# Altium schematic sheet ESP32_S2_SOLO_2.SchDoc
size A4; SheetNumber: 2; SheetTotal: 7
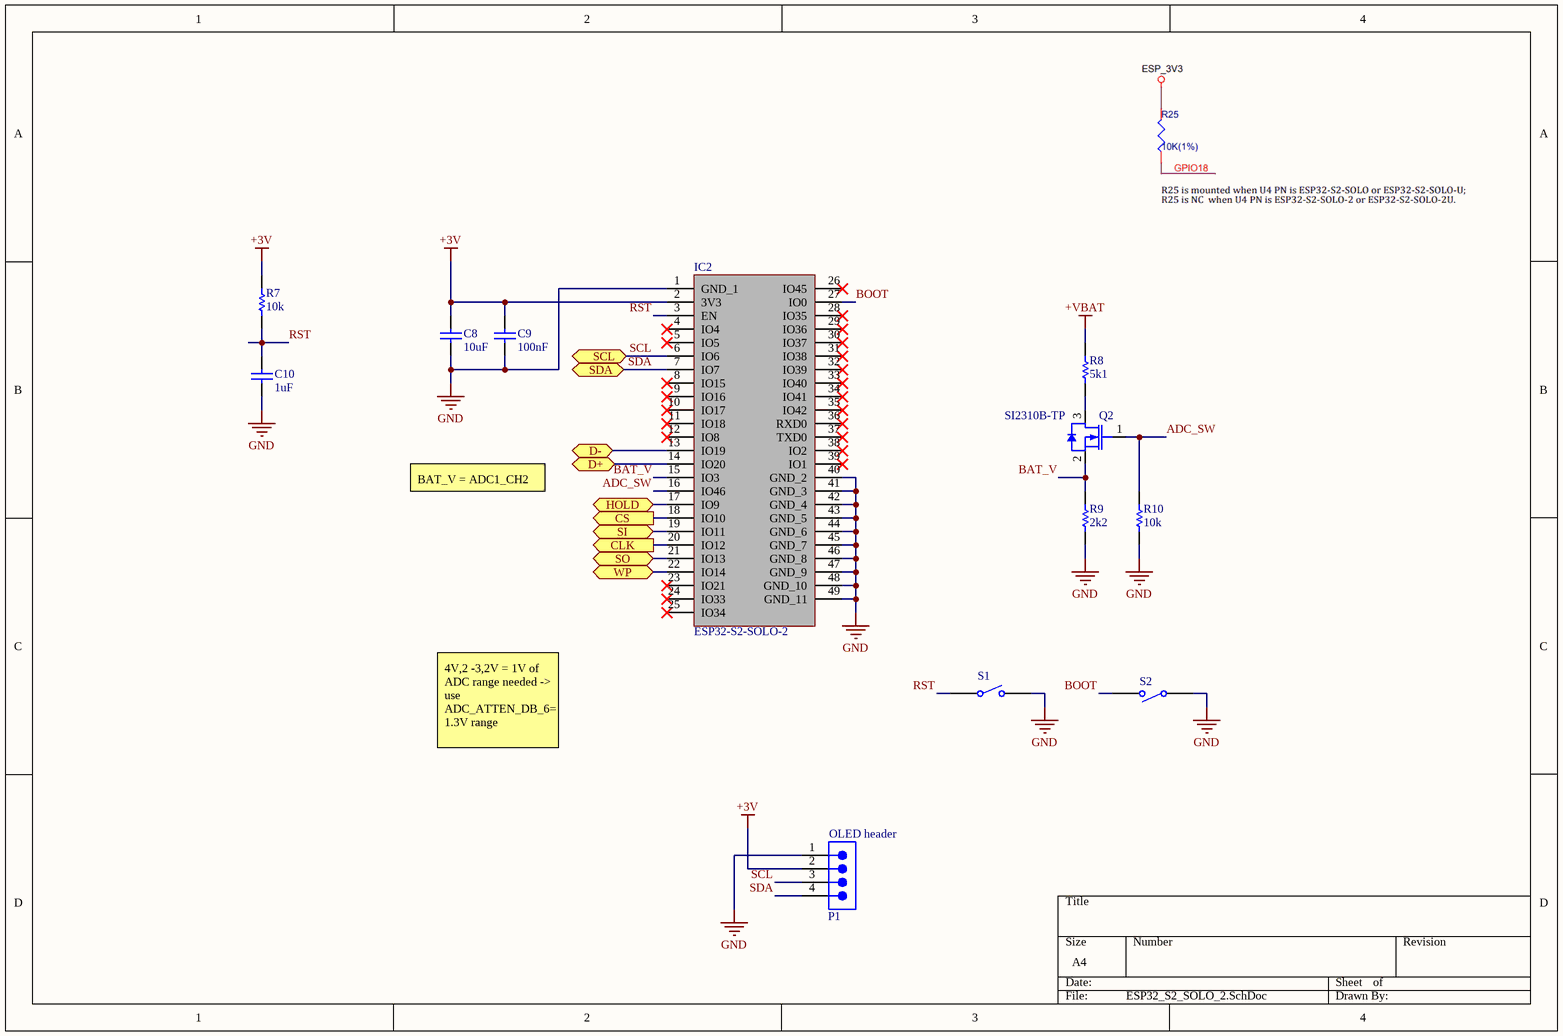
[diagram p0: ESP32_S2_SOLO_2.SchDoc]

## Parts
C8  value 10uF  [Wurth 0603 capacitor]  (hidden comment: Generic Capacitor 10uF 0603)
C9  value 100nF  [Wurth 0603 capacitor]  (hidden comment: Generic Capacitor 100nF 0603)
C10  value 1uF  [Wurth 0603 capacitor]  (hidden comment: Generic Capacitor 1uF 0603)
IC2  ESP32-S2-SOLO-2  [ESPRESSIF ESP32S2SOLO2]
P1  OLED header  [4x1 2.54mm F]
Q2  SI2310B-TP  [MCC SOT-23-3]
R7  value 10k  [Wurth 0603 Resistor]  (hidden comment: Generic Resistor 10k 0603)
R8  value 5k1  [0805 Resistor]  (hidden comment: Generic Resistor 5k1 0805)
R9  value 2k2  [Wurth 0603 Resistor]  (hidden comment: Generic Resistor 2k2 0603)
R10  value 10k  [Wurth 0603 Resistor]  (hidden comment: Generic Resistor 10k 0603)
S1  TS-1088R-02026  [TS1088R02026]  (value not drawn)
S2  TS-1088R-02026  [TS1088R02026]  (value not drawn)

## Ports
CLK (out), CS (out), D+ (bidir), D- (bidir), HOLD (bidir), SCL (bidir), SDA (bidir), SI (bidir), SO (bidir), WP (bidir)

## Nets
+3V: C8.2 C9.2 IC2.2(3V3) P1.2 R7.2
+VBAT: R8.2
GND: C8.1 C9.1 C10.1 IC2.1(GND_1) IC2.40(GND_2) IC2.41(GND_3) IC2.42(GND_4) IC2.43(GND_5) IC2.44(GND_6) IC2.45(GND_7) IC2.46(GND_8) IC2.47(GND_9) IC2.48(GND_10) IC2.49(GND_11) P1.1 R9.1 R10.1 S1.2 S2.1
ADC_SW: IC2.16(IO46) Q2.1(G) R10.2
BAT_V: IC2.15(IO3) Q2.2(S) R9.2
BOOT: IC2.27(IO0) S2.2
CLK: IC2.20(IO12) ; port CLK
CS: IC2.18(IO10) ; port CS
D+: IC2.14(IO20) ; port D+
D-: IC2.13(IO19) ; port D-
HOLD: IC2.17(IO9) ; port HOLD
RST: C10.2 IC2.3(EN) R7.1 S1.1
SCL: IC2.6(IO6) P1.3 ; port SCL
SDA: IC2.7(IO7) P1.4 ; port SDA
SI: IC2.19(IO11) ; port SI
SO: IC2.21(IO13) ; port SO
WP: IC2.22(IO14) ; port WP
NetQ2_3: Q2.3(D) R8.1

Not connected (* = marked no-connect by the designer): IC2 4(IO4)* 5(IO5)* 8(IO15)* 9(IO16)* 10(IO17)* 11(IO18)* 12(IO8)* 23(IO21)* 24(IO33)* 25(IO34)* 26(IO45)* 28(IO35)* 29(IO36)* 30(IO37)* 31(IO38)* 32(IO39)* 33(IO40)* 34(IO41)* 35(IO42)* 36(RXD0)* 37(TXD0)* 38(IO2)* 39(IO1)*

## Notes on the sheet
- BAT_V = ADC1_CH2
- 4V,2 -3,2V = 1V of ADC range needed -> use ADC_ATTEN_DB_6= 1.3V range

## Library data of the parts
IC2 = Espressif ESP32-S2-SOLO-2: Integrated Circuit
P1 = 4P: WR-PHD Pin Header, THT, Vertical, pitch 2.54mm, 1 Row, 4P; Manufacturer Part Number: 61300411121; Manufacturer: Wurth Elektronik; Contact Resistance: 20mOhm; Rated Current: 3A; Working Voltage: 250V; Withstanding Voltage: 500V; Category: Board-to-Board Connectors; Match Code: WR-PHD; ComponentLink1Description: Website Link; ComponentLink1URL: https://www.we-online.com/redexpert/article/61300411121?ad; ComponentLink2Description: Datasheet Link; ComponentLink2URL: https://www.we-online.com/redexpert/spec/61300411121?ad; Mount: Through Hole; Operating Temperature Max: 105°C; Operating Temperature Min: -40°C; Packaging: Bag; Gender: Pin Header; Number of Pins: 4; Number of Rows: 1; Orientation: Vertical; Pitch: 2.54mm
Q2 = MCC SI2310B-TP: Power Field-Effect Transistor; Manufacturer: MCC; Supplier: Digikey; Supplier Part Number: 353-SI2310B-TPCT-ND; Manufacturer Part Number: SI2310B-TP; RoHS: Yes; Stock: 114263; Pricing: 1=0,36, 10=0,255, 100=0,1286, 500=0,10488, 1000=0,07782 (USD)
S1 S2 = XUNPU TS-1088R-02026